# EAGLE design C Axis Endstop (EAGLE 9.6.2)
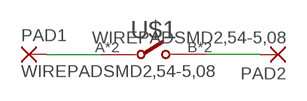
[diagram p0: schematic, sheet 1]

## Parts
PAD1  WIREPADSMD2,54-5,08  [SMD2,54-5,08]
PAD2  WIREPADSMD2,54-5,08  [SMD2,54-5,08]
U$1  SWITCH_LIMIT_HDP001L  [SWITCH_LIMIT_HDP001L]

## Nets
N$1: PAD1.1(P) U$1.A U$1.C
N$2: PAD2.1(P) U$1.B U$1.D

## Library data of the parts
PAD1 PAD2 = wirepad:WIREPAD: Wire PAD connect wire on PCB
U$1 = Shai-Parts:SWITCH_LIMIT_HDP001L

## Board
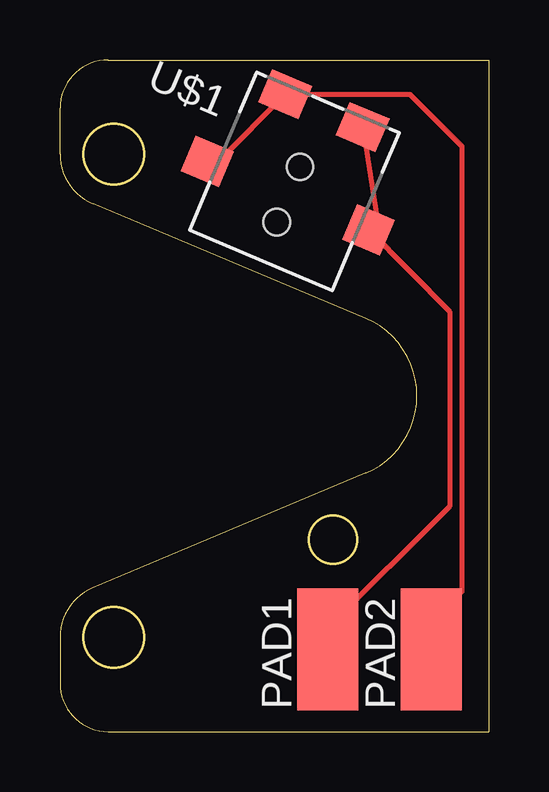
[diagram p1: board, top side]

Size 17.87 x 28 mm. Coordinates in mm from the lower left corner, seen from the top.
Outline: 12.73,10.78 1.37,5.99 arc67 0,3.92 0,2 arc90 2,0 17.88,0 17.88,28 2,28 arc90 0,26 0,24.08 arc67 1.37,22.01 12.73,17.23 arc-134 12.73,10.78
Outline: circle at 2.24,24.08 radius 1.26
Outline: circle at 11.37,8 radius 1
Outline: circle at 2.24,3.92 radius 1.26
Copper layers (1*16): Top 0.035mm / dielectric 1.5mm / Bottom 0.035mm
Design rules "default": minimum track width 6mil, minimum drill 0.35mm, track to track 6mil, track to pad 6mil, pad to pad 6mil, via to via 6mil, smd to smd 6mil, copper to edge 40mil, drill to drill 6mil, minimum pad ring 10mil, minimum via ring 8mil, stop-mask expansion 4mil, vias tented up to drill 0mil, thermal gap 10mil
Holes 1.1 mm at 9.03,21.24 10,23.54

### Footprints (pad centres in the part's own frame; a part is rotated, then mirrored left to right if it is on the bottom)
SMD2,54-5,08 = smd 2.54 x 5.08: 1 0,0
SWITCH_LIMIT_HDP001L = smd 1.8 x 1.5: A -1.75,-5.05; B 1.75,-5.05 | smd 1.7 x 1.6: C -3.65,-1.2; D 3.65,-1.2 | hole 1.1: 0,0; 0,-2.5

### Placement (x,y rotation side)
PAD1  11.16,3.43 0 top
PAD2  15.48,3.43 0 top
U$1  9.03,21.24 157 top

### Tracks (layer width: path | path; a pad name or v marks a point on that pad's centre or on a via)
N$1
  Top 0.203: PAD1.1 11.16,4.32 16.26,9.41 16.26,17.48 U$1.C 13.55,20.22 13.36,20.41 U$1.A
N$2
  Top 0.203: PAD2.1 15.48,4.57 16.74,5.84 16.74,24.41 14.58,26.57 U$1.B 6.59,23.77 U$1.D